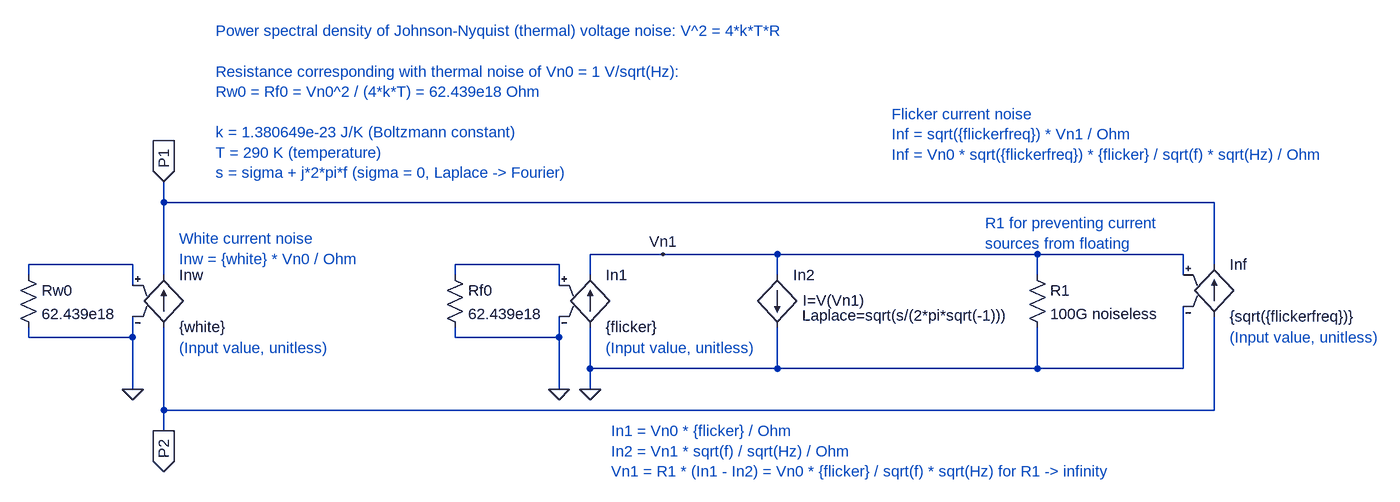
[diagram p0: schematic inoise.asc]
inoise.asc, the LTspice schematic file:
Version 4
SHEET 1 5244 1232
WIRE 3360 -1456 3360 -1488
WIRE 4976 -1456 3360 -1456
WIRE 4128 -1376 4016 -1376
WIRE 4304 -1376 4128 -1376
WIRE 4704 -1376 4304 -1376
WIRE 4928 -1376 4704 -1376
WIRE 3312 -1360 3152 -1360
WIRE 3968 -1360 3808 -1360
WIRE 4976 -1360 4976 -1456
WIRE 3152 -1344 3152 -1360
WIRE 3360 -1344 3360 -1456
WIRE 3808 -1344 3808 -1360
WIRE 4016 -1344 4016 -1376
WIRE 4304 -1344 4304 -1376
WIRE 4704 -1344 4704 -1376
WIRE 4928 -1344 4928 -1376
WIRE 3312 -1328 3312 -1360
WIRE 3968 -1328 3968 -1360
WIRE 3152 -1248 3152 -1264
WIRE 3312 -1248 3312 -1280
WIRE 3312 -1248 3152 -1248
WIRE 3808 -1248 3808 -1264
WIRE 3968 -1248 3968 -1280
WIRE 3968 -1248 3808 -1248
WIRE 4016 -1200 4016 -1264
WIRE 4304 -1200 4304 -1264
WIRE 4304 -1200 4016 -1200
WIRE 4704 -1200 4704 -1264
WIRE 4704 -1200 4304 -1200
WIRE 4928 -1200 4928 -1296
WIRE 4928 -1200 4704 -1200
WIRE 3312 -1168 3312 -1248
WIRE 3968 -1168 3968 -1248
WIRE 4016 -1168 4016 -1200
WIRE 3360 -1136 3360 -1264
WIRE 4976 -1136 4976 -1280
WIRE 4976 -1136 3360 -1136
WIRE 3360 -1104 3360 -1136
FLAG 3360 -1488 P1
IOPIN 3360 -1488 In
FLAG 3360 -1104 P2
IOPIN 3360 -1104 Out
FLAG 3968 -1168 0
FLAG 4016 -1168 0
FLAG 3312 -1168 0
FLAG 4128 -1376 Vn1
SYMBOL g 3360 -1360 R0
SYMATTR InstName Inw
SYMATTR Value {white}
SYMBOL res 3136 -1360 R0
SYMATTR InstName Rw0
SYMATTR Value 62.439e18
SYMBOL res 3792 -1360 R0
SYMATTR InstName Rf0
SYMATTR Value 62.439e18
SYMBOL bi 4304 -1344 R0
WINDOW 3 39 39 Left 2
WINDOW 123 38 62 Left 2
SYMATTR Value I=V(Vn1)
SYMATTR Value2 Laplace=sqrt(s/(2*pi*sqrt(-1)))
SYMATTR InstName In2
SYMBOL g 4976 -1376 R0
SYMATTR InstName Inf
SYMATTR Value {sqrt({flickerfreq})}
SYMBOL res 4688 -1360 R0
SYMATTR InstName R1
SYMATTR Value 100G noiseless
SYMBOL g 4016 -1360 R0
SYMATTR InstName In1
SYMATTR Value {flicker}
TEXT 3384 -1400 Left 2 ;White current noise\nInw = {white} * Vn0 / Ohm
TEXT 3384 -1232 Left 2 ;(Input value, unitless)
TEXT 3440 -1720 Left 2 ;Power spectral density of Johnson-Nyquist (thermal) voltage noise: V^2 = 4*k*T*R\n \nResistance corresponding with thermal noise of Vn0 = 1 V/sqrt(Hz):\nRw0 = Rf0 = Vn0^2 / (4*k*T) = 62.439e18 Ohm\n \nk = 1.380649e-23 J/K (Boltzmann constant)\nT = 290 K (temperature)\ns = sigma + j*2*pi*f (sigma = 0, Laplace -> Fourier)
TEXT 4040 -1232 Left 2 ;(Input value, unitless)
TEXT 4624 -1424 Left 2 ;R1 for preventing current\nsources from floating
TEXT 5000 -1248 Left 2 ;(Input value, unitless)
TEXT 4048 -1104 Left 2 ;In1 = Vn0 * {flicker} / Ohm\nIn2 = Vn1 * sqrt(f) / sqrt(Hz) / Ohm\nVn1 = R1 * (In1 - In2) = Vn0 * {flicker} / sqrt(f) * sqrt(Hz) for R1 -> infinity
TEXT 4480 -1592 Left 2 ;Flicker current noise\nInf = sqrt({flickerfreq}) * Vn1 / Ohm\nInf = Vn0 * sqrt({flickerfreq}) * {flicker} / sqrt(f) * sqrt(Hz) / Ohm

The netlist it stands for:
* inoise.asc
G§Inw P2 P1 N001 0 {white}
Rw0 N001 0 62.439e18
Rf0 N002 0 62.439e18
B§In2 Vn1 0 I=V(Vn1) Laplace=sqrt(s/(2*pi*sqrt(-1)))
G§Inf P2 P1 Vn1 0 {sqrt({flickerfreq})}
R1 Vn1 0 100G noiseless
G§In1 0 Vn1 N002 0 {flicker}
* White current noise
* Inw = {white} * Vn0 / Ohm
* (Input value, unitless)
* Power spectral density of Johnson-Nyquist (thermal) voltage noise: V^2 = 4*k*T*R
* Resistance corresponding with thermal noise of Vn0 = 1 V/sqrt(Hz):
* Rw0 = Rf0 = Vn0^2 / (4*k*T) = 62.439e18 Ohm
* k = 1.380649e-23 J/K (Boltzmann constant)
* T = 290 K (temperature)
* s = sigma + j*2*pi*f (sigma = 0, Laplace -> Fourier)
* (Input value, unitless)
* R1 for preventing current
* sources from floating
* (Input value, unitless)
* In1 = Vn0 * {flicker} / Ohm
* In2 = Vn1 * sqrt(f) / sqrt(Hz) / Ohm
* Vn1 = R1 * (In1 - In2) = Vn0 * {flicker} / sqrt(f) * sqrt(Hz) for R1 -> infinity
* Flicker current noise
* Inf = sqrt({flickerfreq}) * Vn1 / Ohm
* Inf = Vn0 * sqrt({flickerfreq}) * {flicker} / sqrt(f) * sqrt(Hz) / Ohm
.backanno
.end